# Altium schematic sheet WIP.SchDoc (part 1 of 3)
size E
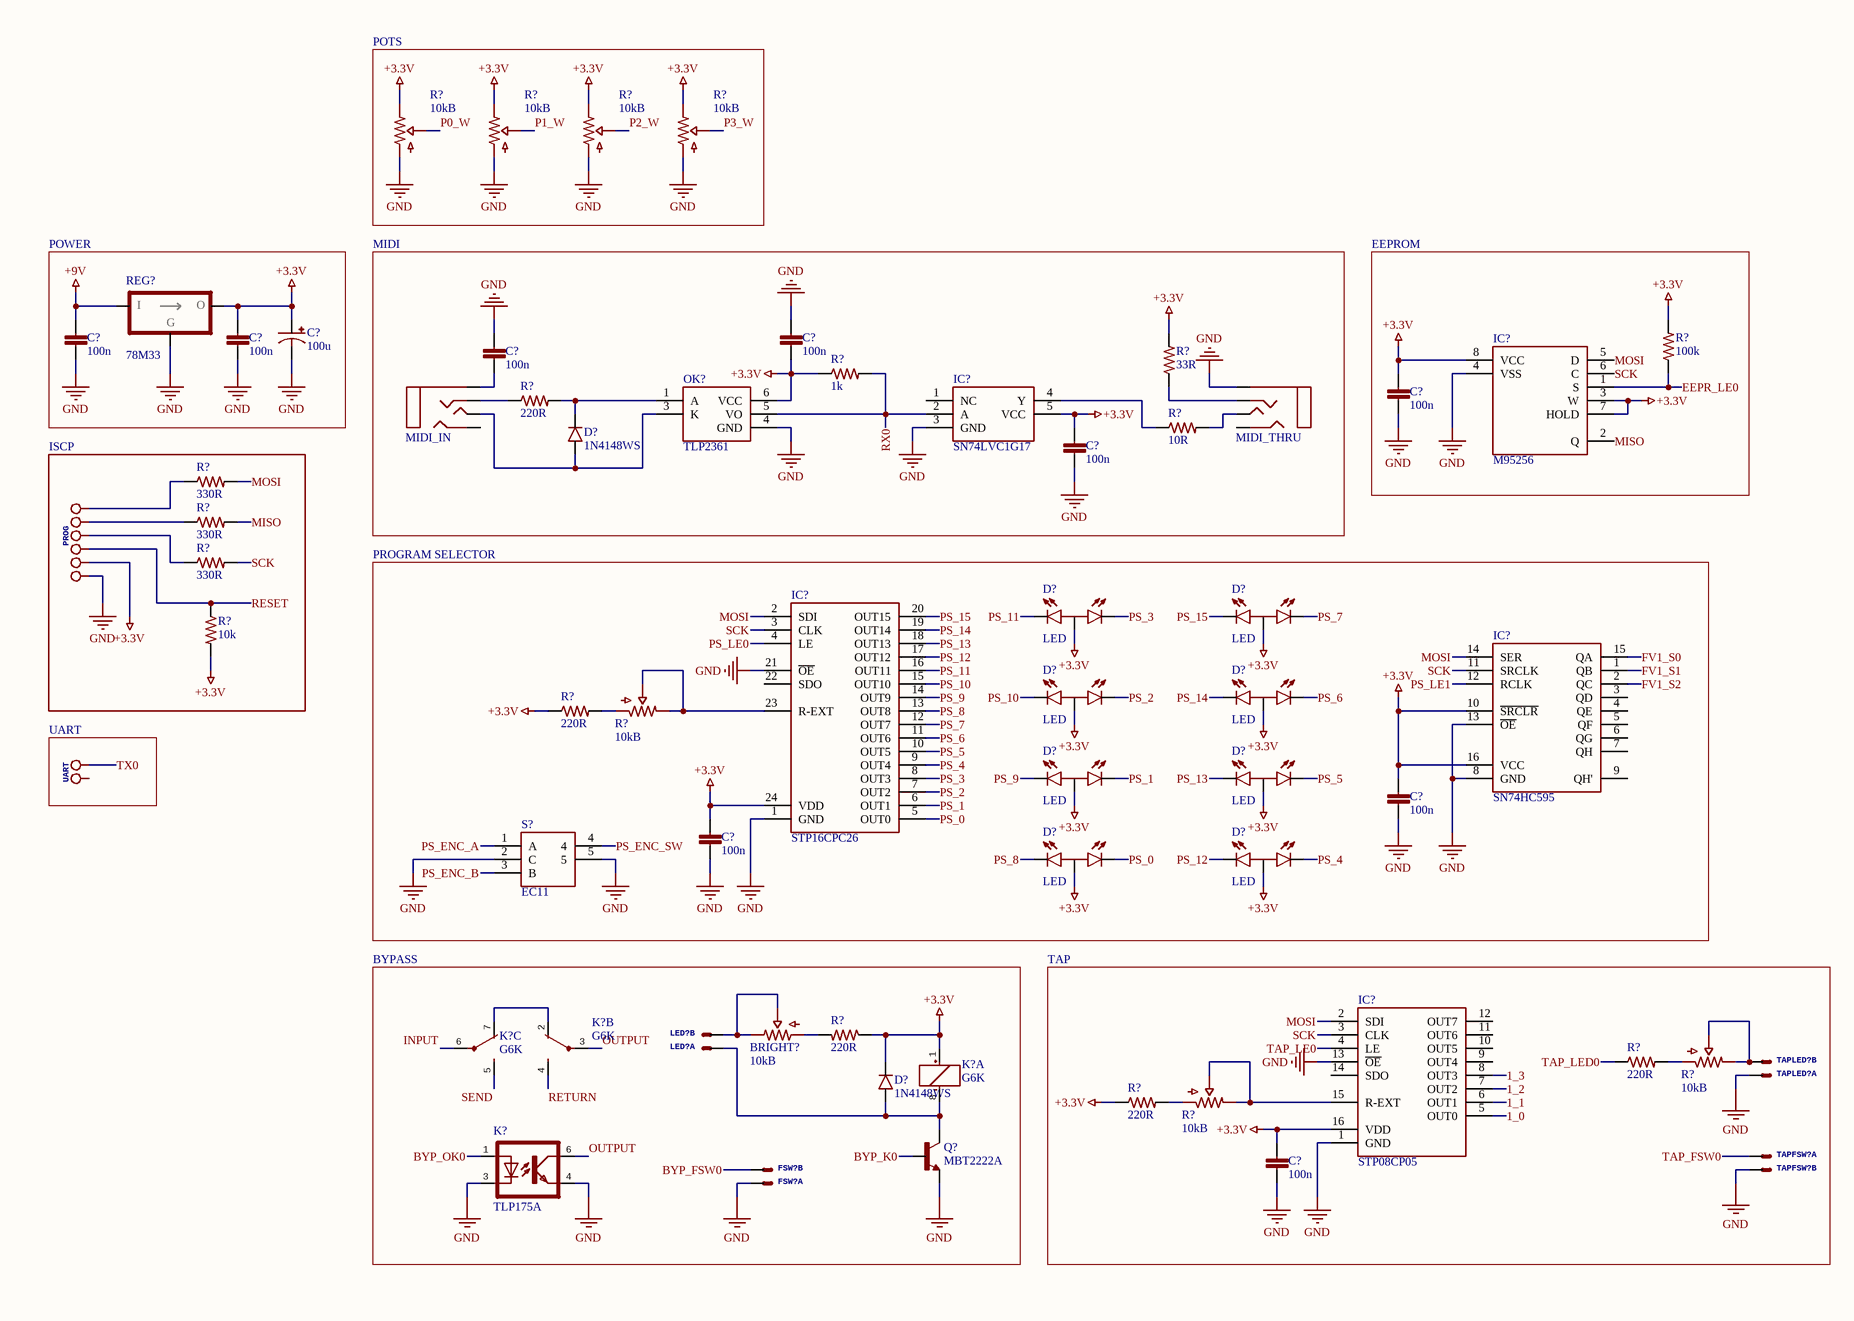
[diagram p0: WIP.SchDoc, top left]
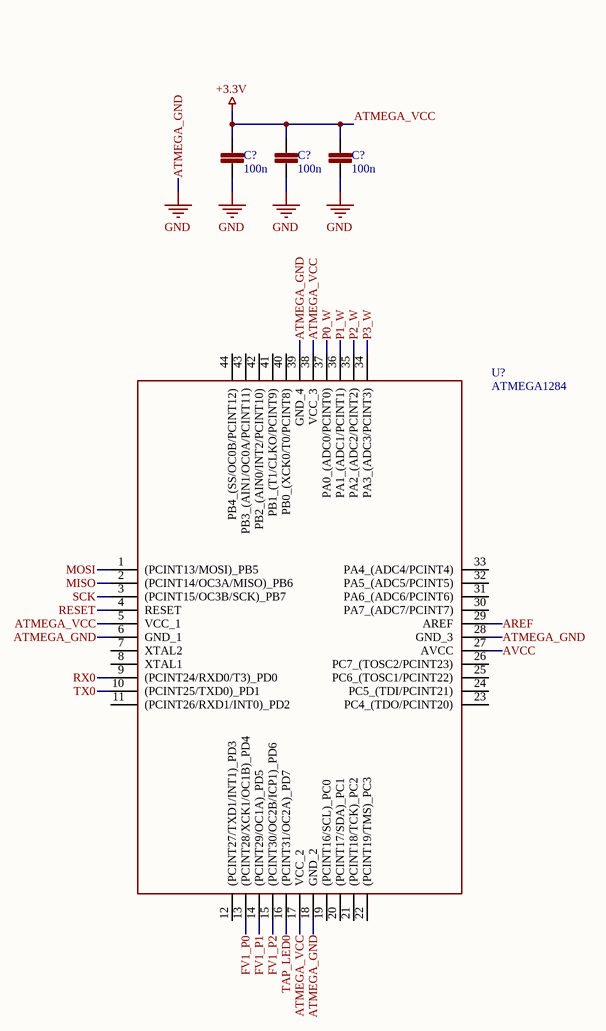
[diagram p1: WIP.SchDoc, top right]
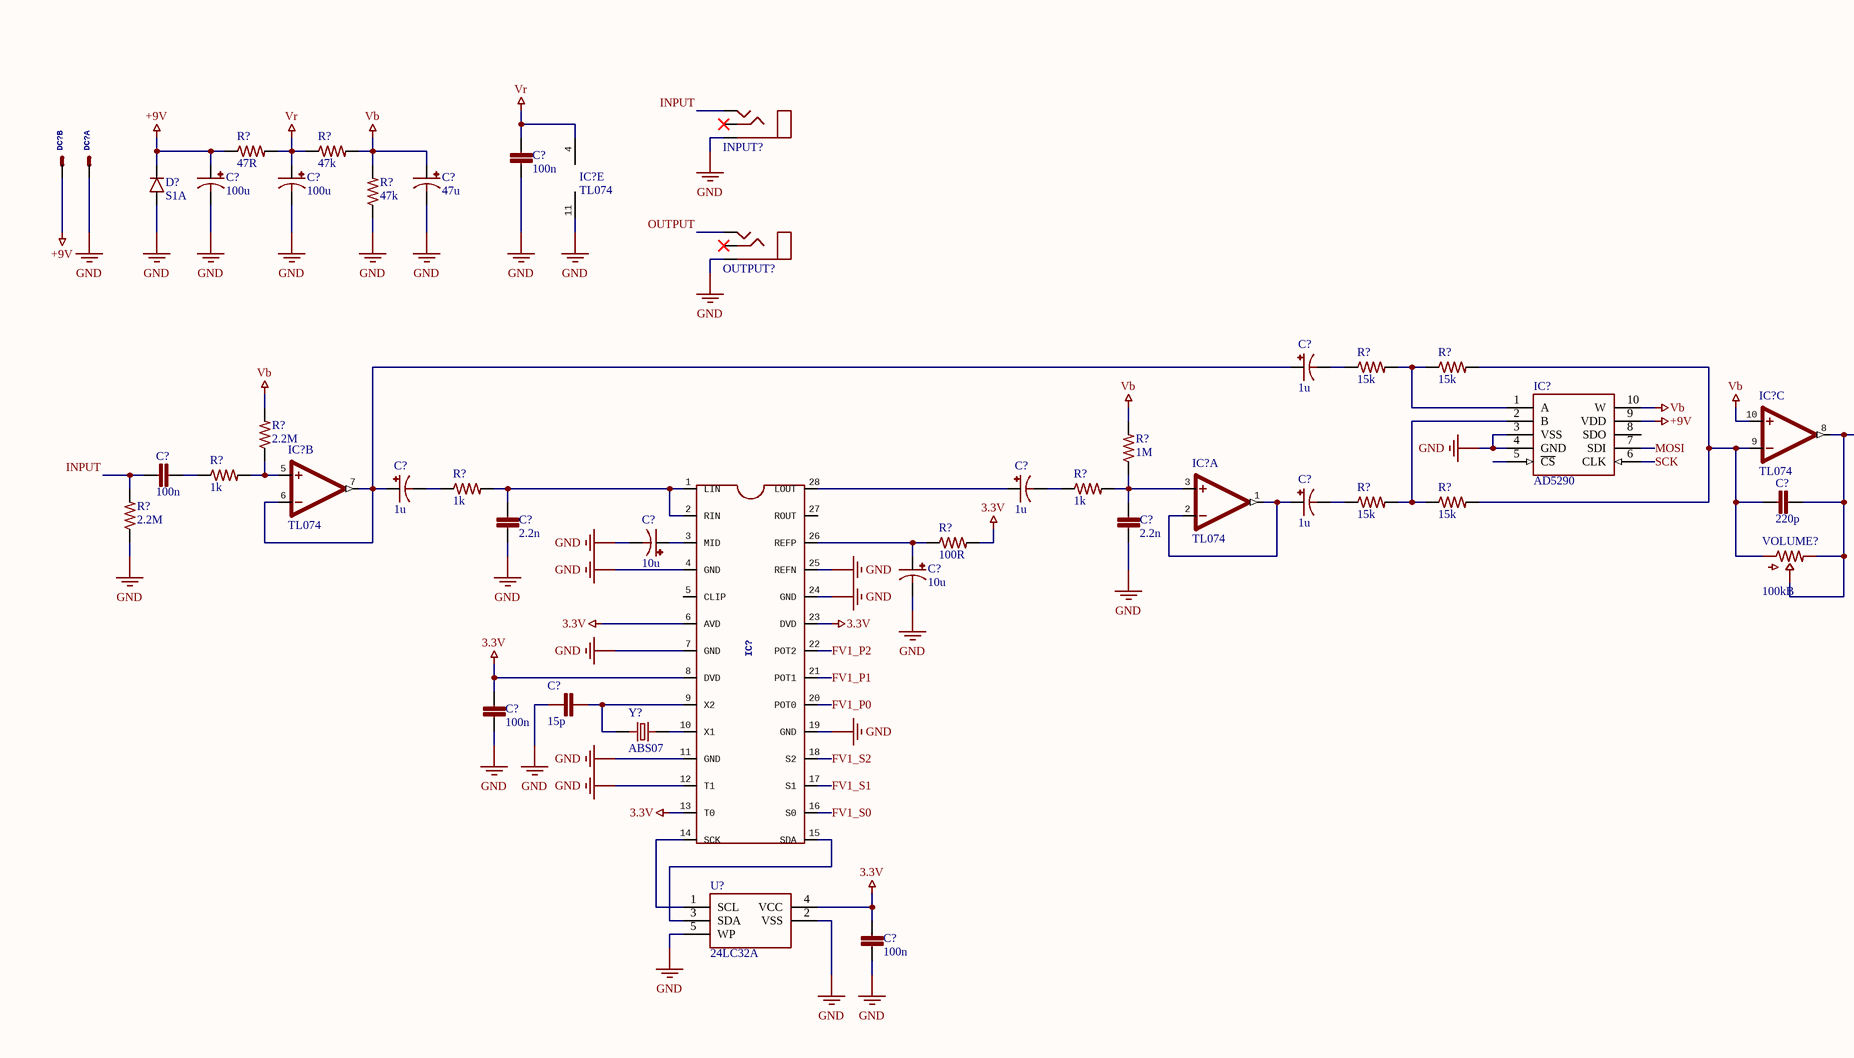
[diagram p2: WIP.SchDoc, bottom left]
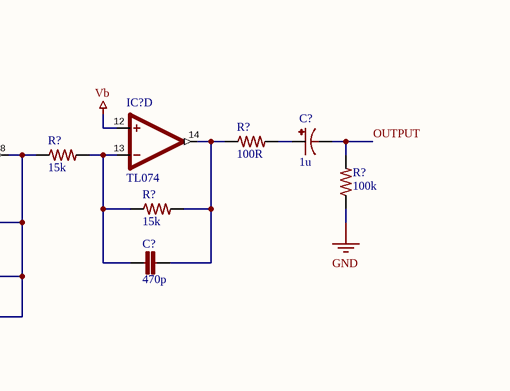
[diagram p3: WIP.SchDoc, bottom right]

## Parts
(Parts that share a designator on the sheet are numbered #1, #2 ... from top to bottom, then left to right.)
BRIGHT?  10kB  [BOURNS_3362P]
C?#1  100u  [CAPAE_D]
C?#2  100n  [CHIP_0603]
C?#3  100n  [CHIP_0603]
C?#4  100n  [CHIP_0603]
C?#5  100n  [CHIP_0603]
C?#6  100n  [CHIP_0603]
C?#7  100n  [CHIP_0603]
C?#8  100n  [CHIP_0603]
C?#9  100n  [CHIP_0603]
C?#10  100n  [CHIP_0603]
C?#11  100n  [CHIP_0603]
C?#12  100n  [CHIP_0603]
C?#13  100n  [CHIP_0603]
C?#14  100n  [CHIP_0603]
C?#15  100u  [CAPAE_D]
C?#16  100u  [CAPAE_D]
C?#17  47u  [CAPAE_D]
C?#18  1u  [CAPAE_B]
C?#19  1u  [CAPAE_B]
C?#20  100n  [CHIP_1206]
C?#21  1u  [CAPAE_B]
C?#22  1u  [CAPAE_B]
C?#23  1u  [CAPAE_B]
C?#24  220p  [CHIP_0603]
C?#25  2.2n  [CHIP_0603]
C?#26  2.2n  [CHIP_0603]
C?#27  10u  [CAPAE_B]
C?#28  470p  [CHIP_0603]
C?#29  10u  [CAPAE_B]
C?#30  15p  [CER_050]
C?#31  100n  [CHIP_0603]
C?#32  100n  [CHIP_0603]
D?#1  1N4148WS  [SOD323]
D?#2  LED  [LED_3MM_BICOLOR]
D?#3  LED  [LED_3MM_BICOLOR]
D?#4  LED  [LED_3MM_BICOLOR]
D?#5  LED  [LED_3MM_BICOLOR]
D?#6  LED  [LED_3MM_BICOLOR]
D?#7  LED  [LED_3MM_BICOLOR]
D?#8  LED  [LED_3MM_BICOLOR]
D?#9  LED  [LED_3MM_BICOLOR]
D?#10  1N4148WS  [SOD323]
D?#11  S1A  [DO214]
DC?#1  J_JST-XH-02  [JST-XH-02]  (value not drawn)  (part B of 2)
DC?#2  J_JST-XH-02  [JST-XH-02]  (value not drawn)  (part A of 2)
FSW?#1  (no value)  [JST-XH-02]  (part B of 2)
FSW?#2  (no value)  [JST-XH-02]  (part A of 2)
IC?#1  M95256  [TSSOP-8]
IC?#2  SN74LVC1G17  [SOT-23-5]
IC?#3  SN74HC595  [TSSOP-16]
IC?#4  STP16CPC26  [TSSOP-24]
IC?#5  STP08CP05  [TSSOP-16]
IC?#6  TL074  [SO-14]  (part E of 5)
IC?#7  TL074  [SO-14]  (part D of 5)
IC?#8  AD5290  [MSOP-10]
IC?#9  TL074  [SO-14]  (part C of 5)
IC?#10  TL074  [SO-14]  (part B of 5)
IC?#11  TL074  [SO-14]  (part A of 5)
IC?#12  IC_FV-1  [SOIC28]  (value not drawn)
INPUT?  J_STEREO  [STEREO]  (value not drawn)
K?#1  G6K  [G6K]  (part C of 3)
K?#2  G6K  [G6K]  (part B of 3)
K?#3  G6K  [G6K]  (part A of 3)
K?#4  TLP175A  [TLP175A]
LED?#1  (no value)  [JST-XH-02]  (part B of 2)
LED?#2  (no value)  [JST-XH-02]  (part A of 2)
MIDI_IN  J_STEREO_3.5  [STEREO_3.5]  (value not drawn)
MIDI_THRU  J_STEREO_3.5  [STEREO_3.5]  (value not drawn)
OK?  TLP2361  [TLP2361]
OUTPUT?  J_STEREO  [STEREO]  (value not drawn)
PROG  J_HEADER_6PINS_FEM  [HEADER_6Pins_FEM]  (value not drawn)
Q?  MBT2222A  [SOT323]
R?#1  10kB  [ALPHA_9MM_TOP]
R?#2  10kB  [ALPHA_9MM_TOP]
R?#3  10kB  [ALPHA_9MM_TOP]
R?#4  10kB  [ALPHA_9MM_TOP]
R?#5  100k  [CHIP_R_0603]
R?#6  33R  [CHIP_R_0603]
R?#7  1k  [CHIP_R_0603]
R?#8  220R  [CHIP_R_0603]
R?#9  10R  [CHIP_R_0603]
R?#10  330R  [CHIP_R_0603]
R?#11  330R  [CHIP_R_0603]
R?#12  330R  [CHIP_R_0603]
R?#13  10k  [CHIP_R_0603]
R?#14  220R  [CHIP_R_1206]
R?#15  10kB  [BOURNS_3362P]
R?#16  220R  [CHIP_R_1206]
R?#17  220R  [CHIP_R_1206]
R?#18  10kB  [BOURNS_3362P]
R?#19  220R  [CHIP_R_1206]
R?#20  10kB  [BOURNS_3362P]
R?#21  47R  [CHIP_R_1206]
R?#22  47k  [CHIP_R_1206]
R?#23  47k  [CHIP_R_1206]
R?#24  15k  [CHIP_R_0603]
R?#25  15k  [CHIP_R_0603]
R?#26  100R  [CHIP_R_0603]
R?#27  2.2M  [CHIP_R_0603]
R?#28  15k  [CHIP_R_0603]
R?#29  1M  [CHIP_R_0603]
R?#30  100k  [CHIP_R_0603]
R?#31  1k  [CHIP_R_0603]
R?#32  1k  [CHIP_R_0603]
R?#33  1k  [CHIP_R_0603]
R?#34  15k  [CHIP_R_0603]
R?#35  15k  [CHIP_R_0603]
R?#36  15k  [CHIP_R_0603]
R?#37  2.2M  [CHIP_R_0603]
R?#38  100R  [CHIP_R_0603]
REG?  78M33  [SOT223]
S?  EC11  [ALPHA_EC11]
TAPFSW?#1  (no value)  [JST-XH-02]  (part A of 2)
TAPFSW?#2  (no value)  [JST-XH-02]  (part B of 2)
TAPLED?#1  (no value)  [JST-XH-02]  (part B of 2)
TAPLED?#2  (no value)  [JST-XH-02]  (part A of 2)
U?#1  ATMEGA1284  [TQFP44]
U?#2  24LC32A  [SOT-23-5]
UART  J_HEADER_2PINS_FEM  [HEADER_2Pins_FEM]  (value not drawn)
VOLUME?  100kB  [ALPHA_9MM_TRIM_TOP]
Y?  ABS07

## Blocks framed on the sheet
POTS: R?#1-R?#4
POWER: C?#1 C?#3 C?#4 REG?
MIDI: C?#2 C?#5 C?#10 D?#1 IC?#2 MIDI_IN MIDI_THRU OK? R?#6-R?#9
EEPROM: C?#9 IC?#1 R?#5
ISCP: PROG R?#10-R?#13
PROGRAM SELECTOR: C?#11 C?#12 D?#2-D?#9 IC?#3 IC?#4 R?#14 R?#15 S?
UART: UART
BYPASS: BRIGHT? D?#10 FSW?#1 FSW?#2 K?#1-K?#4 LED?#1 LED?#2 Q? R?#16
TAP: C?#13 IC?#5 R?#17-R?#20 TAPFSW?#1 TAPFSW?#2 TAPLED?#1 TAPLED?#2

## Nets
3.3V: C?#31.1 C?#32.1 IC?#12.6(AVD) IC?#12.8(DVD) IC?#12.13(T0) IC?#12.23(DVD) R?#38.2 U?#2.4(VCC)
+9V: C?#3.1 C?#15.+ D?#11.1 DC?#1.1(S) IC?#8.9(VDD) R?#21.1 REG?.2(INPUT)
ATMEGA_GND: C?#1.- C?#2.2 C?#3.2 C?#4.2 C?#5.2 C?#6.2 C?#7.2 C?#8.2 C?#9.1 C?#10.1 C?#11.1 C?#12.2 C?#13.2 C?#14.2 C?#15.- C?#16.- C?#17.- C?#25.2 C?#26.2 C?#27.- C?#29.- C?#30.2 C?#31.2 C?#32.2 D?#11.2 DC?#2.2(S) FSW?#2.2(S) IC?#1.4(VSS) IC?#2.3(GND) IC?#3.8(GND) IC?#3.13(~{OE}) IC?#4.1(GND) IC?#4.21(~{OE}) IC?#5.1(GND) IC?#5.13(~{OE}) IC?#6.11(V-) IC?#8.3(VSS) IC?#8.4(GND) IC?#12.4(GND) IC?#12.7(GND) IC?#12.11(GND) IC?#12.12(T1) IC?#12.19(GND) IC?#12.24(GND) IC?#12.25(REFN) INPUT?.S K?#4.3(C) K?#4.4(EMIT) MIDI_THRU.1 OK?.4(GND) OUTPUT?.S PROG.6 Q?.2(E) R?#1.1 R?#2.1 R?#3.1 R?#4.1 R?#23.1 R?#30.1 R?#37.1 REG?.3(COMMON) S?.2(C) S?.5 TAPFSW?#2.1(S) TAPLED?#2.2(S) U?#1.6(GND_1) U?#1.18(GND_2) U?#1.28(GND_3) U?#1.39(GND_4) U?#2.2(VSS) U?#2.5(WP)  [also labelled GND]
ATMEGA_VCC: C?#1.+ C?#2.1 C?#4.1 C?#6.1 C?#7.1 C?#8.1 C?#9.2 C?#10.2 C?#11.2 C?#12.1 C?#13.1 D?#2.2 D?#3.2 D?#4.2 D?#5.2 D?#6.2 D?#7.2 D?#8.2 D?#9.2 D?#10.1 IC?#1.3(W) IC?#1.7(HOLD) IC?#1.8(VCC) IC?#2.5(VCC) IC?#3.10(~{SRCLR}) IC?#3.16(VCC) IC?#4.24(VDD) IC?#5.16(VDD) K?#3.1(+) OK?.6(VCC) PROG.5 R?#1.3 R?#2.3 R?#3.3 R?#4.3 R?#5.2 R?#6.2 R?#7.1 R?#13.2 R?#14.1 R?#16.1 R?#19.1 REG?.1(OUTPUT) U?#1.5(VCC_1) U?#1.17(VCC_2) U?#1.38(VCC_3)  [also labelled +3.3V]
Vb: C?#17.+ IC?#7.12(+IN) IC?#8.10(W) IC?#9.10(+IN) R?#22.2 R?#23.2 R?#27.2 R?#29.2
Vr: C?#14.1 C?#16.+ IC?#6.4(V+) R?#21.2 R?#22.1
1_0: IC?#5.5(OUT0)
1_1: IC?#5.6(OUT1)
1_2: IC?#5.7(OUT2)
1_3: IC?#5.8(OUT3)
AREF: U?#1.29(AREF)
AVCC: U?#1.27(AVCC)
BYP_FSW0: FSW?#1.1(S)
BYP_K0: Q?.1(B)
BYP_OK0: K?#4.1(A)
EEPR_LE0: IC?#1.1(S) R?#5.1
FV1_P0: IC?#12.20(POT0) U?#1.13((PCINT28/XCK1/OC1B)_PD4)
FV1_P1: IC?#12.21(POT1) U?#1.14((PCINT29/OC1A)_PD5)
FV1_P2: IC?#12.22(POT2) U?#1.15((PCINT30/OC2B/ICP1)_PD6)
FV1_S0: IC?#3.15(QA) IC?#12.16(S0)
FV1_S1: IC?#3.1(QB) IC?#12.17(S1)
FV1_S2: IC?#3.2(QC) IC?#12.18(S2)
INPUT: C?#20.2 INPUT?.T K?#1.6(P) R?#37.2
MISO: IC?#1.2(Q) R?#11.2 U?#1.2((PCINT14/OC3A/MISO)_PB6)
MOSI: IC?#1.5(D) IC?#3.14(SER) IC?#4.2(SDI) IC?#5.2(SDI) IC?#8.7(SDI) R?#10.2 U?#1.1((PCINT13/MOSI)_PB5)
OUTPUT: C?#19.- K?#2.3(P) K?#4.6(COL) OUTPUT?.T R?#30.2
P0_W: R?#1.2 U?#1.37(PA0_(ADC0/PCINT0))
P1_W: R?#2.2 U?#1.36(PA1_(ADC1/PCINT1))
P2_W: R?#3.2 U?#1.35(PA2_(ADC2/PCINT2))
P3_W: R?#4.2 U?#1.34(PA3_(ADC3/PCINT3))
PS_0: D?#8.1 IC?#4.5(OUT0)
PS_1: D?#6.1 IC?#4.6(OUT1)
PS_2: D?#4.1 IC?#4.7(OUT2)
PS_3: D?#2.1 IC?#4.8(OUT3)
PS_4: D?#9.1 IC?#4.9(OUT4)
PS_5: D?#7.1 IC?#4.10(OUT5)
PS_6: D?#5.1 IC?#4.11(OUT6)
PS_7: D?#3.1 IC?#4.12(OUT7)
PS_8: D?#8.3 IC?#4.13(OUT8)
PS_9: D?#6.3 IC?#4.14(OUT9)
PS_10: D?#4.3 IC?#4.15(OUT10)
PS_11: D?#2.3 IC?#4.16(OUT11)
PS_12: D?#9.3 IC?#4.17(OUT12)
PS_13: D?#7.3 IC?#4.18(OUT13)
PS_14: D?#5.3 IC?#4.19(OUT14)
PS_15: D?#3.3 IC?#4.20(OUT15)
PS_ENC_A: S?.1(A)
PS_ENC_B: S?.3(B)
PS_ENC_SW: S?.4
PS_LE0: IC?#4.4(LE)
PS_LE1: IC?#3.12(RCLK)
RESET: PROG.4 R?#13.1 U?#1.4(RESET)
RETURN: K?#2.4(S)
RX0: IC?#2.2(A) OK?.5(VO) R?#7.2 U?#1.9((PCINT24/RXD0/T3)_PD0)
SCK: IC?#1.6(C) IC?#3.11(SRCLK) IC?#4.3(CLK) IC?#5.3(CLK) IC?#8.6(CLK) R?#12.2 U?#1.3((PCINT15/OC3B/SCK)_PB7)
SEND: K?#1.5(S)
TAP_FSW0: TAPFSW?#1.2(S)
TAP_LE0: IC?#5.4(LE)
TAP_LED0: R?#17.1 U?#1.16((PCINT31/OC2A)_PD7)
TX0: U?#1.10((PCINT25/TXD0)_PD1) UART.1
NetBRIGHT?_1: BRIGHT?.1 R?#16.2
NetBRIGHT?_2: BRIGHT?.2 BRIGHT?.3 LED?#1.1(S)
NetC?#5_1: C?#5.1 MIDI_IN.1
NetC?#18_+: C?#18.+ C?#21.+ IC?#10.6(-IN) IC?#10.7(OUT)
NetC?#18_-: C?#18.- R?#24.1
NetC?#19_+: C?#19.+ R?#26.2
NetC?#20_1: C?#20.1 R?#31.1
NetC?#21_-: C?#21.- R?#32.1
NetC?#22_+: C?#22.+ IC?#12.28(LOUT)
NetC?#22_-: C?#22.- R?#33.1
NetC?#23_+: C?#23.+ IC?#11.1(OUT) IC?#11.2(-IN)
NetC?#23_-: C?#23.- R?#35.1
NetC?#24_1: C?#24.1 IC?#9.8(OUT) R?#28.1 VOLUME?.2 VOLUME?.3
NetC?#24_2: C?#24.2 IC?#9.9(-IN) R?#25.2 R?#36.2 VOLUME?.1
NetC?#25_1: C?#25.1 IC?#12.1(LIN) IC?#12.2(RIN) R?#32.2
NetC?#26_1: C?#26.1 IC?#11.3(+IN) R?#29.1 R?#33.2
NetC?#27_+: C?#27.+ IC?#12.3(MID)
NetC?#28_1: C?#28.1 IC?#7.14(OUT) R?#26.1 R?#34.2
NetC?#28_2: C?#28.2 IC?#7.13(-IN) R?#28.2 R?#34.1
NetC?#29_+: C?#29.+ IC?#12.26(REFP) R?#38.1
NetC?#30_1: C?#30.1 IC?#12.9(X2) Y?.1
NetD?#1_1: D?#1.1 OK?.1(A) R?#8.2
NetD?#1_2: D?#1.2 MIDI_IN.3 OK?.3(K)
NetD?#10_2: D?#10.2 K?#3.8(-) LED?#2.2(S) Q?.3(C)
NetIC?#2_4: IC?#2.4(Y) R?#9.1
NetIC?#4_23: IC?#4.23(R-EXT) R?#15.2 R?#15.3
NetIC?#5_15: IC?#5.15(R-EXT) R?#20.2 R?#20.3
NetIC?#8_1: IC?#8.1(A) R?#24.2 R?#25.1
NetIC?#8_2: IC?#8.2(B) R?#35.2 R?#36.1
NetIC?#10_5: IC?#10.5(+IN) R?#27.1 R?#31.2
NetIC?#12_10: IC?#12.10(X1) Y?.2
NetIC?#12_14: IC?#12.14(SCK) U?#2.1(SCL)
NetIC?#12_15: IC?#12.15(SDA) U?#2.3(SDA)
NetK?#1_7: K?#1.7(O) K?#2.2(O)
NetMIDI_IN_2: MIDI_IN.2 R?#8.1
NetMIDI_THRU_2: MIDI_THRU.2 R?#6.1
NetMIDI_THRU_3: MIDI_THRU.3 R?#9.2
NetPROG_1: PROG.1 R?#10.1
NetPROG_2: PROG.2 R?#11.1
NetPROG_3: PROG.3 R?#12.1
NetR?#14_2: R?#14.2 R?#15.1
NetR?#17_2: R?#17.2 R?#18.1
NetR?#18_2: R?#18.2 R?#18.3 TAPLED?#1.1(S)
NetR?#19_2: R?#19.2 R?#20.1

Not connected (* = marked no-connect by the designer): IC?#2 1(NC); IC?#3 3(QD) 4(QE) 5(QF) 6(QG) 7(QH) 9(QH'); IC?#4 22(SDO); IC?#5 9(OUT4) 10(OUT5) 11(OUT6) 12(OUT7) 14(SDO); IC?#8 5(~{CS}) 8(SDO); IC?#12 5(CLIP) 27(ROUT); INPUT? R*; MIDI_IN 4; MIDI_THRU 4; OUTPUT? R*; U?#1 7(XTAL2) 8(XTAL1) 11((PCINT26/RXD1/INT0)_PD2) 12((PCINT27/TXD1/INT1)_PD3) 19((PCINT16/SCL)_PC0) 20((PCINT17/SDA)_PC1) 21((PCINT18/TCK)_PC2) 22((PCINT19/TMS)_PC3) 23(PC4_(TDO/PCINT20)) 24(PC5_(TDI/PCINT21)) 25(PC6_(TOSC1/PCINT22)) 26(PC7_(TOSC2/PCINT23)) 30(PA7_(ADC7/PCINT7)) 31(PA6_(ADC6/PCINT6)) 32(PA5_(ADC5/PCINT5)) 33(PA4_(ADC4/PCINT4)) 40(PB0_(XCK0/T0/PCINT8)) 41(PB1_(T1/CLKO/PCINT9)) 42(PB2_(AIN0/INT2/PCINT10)) 43(PB3_(AIN1/OC0A/PCINT11)) 44(PB4_(SS/OC0B/PCINT12)); UART 2